# Altium schematic sheet IMU_Core.SchDoc
size A
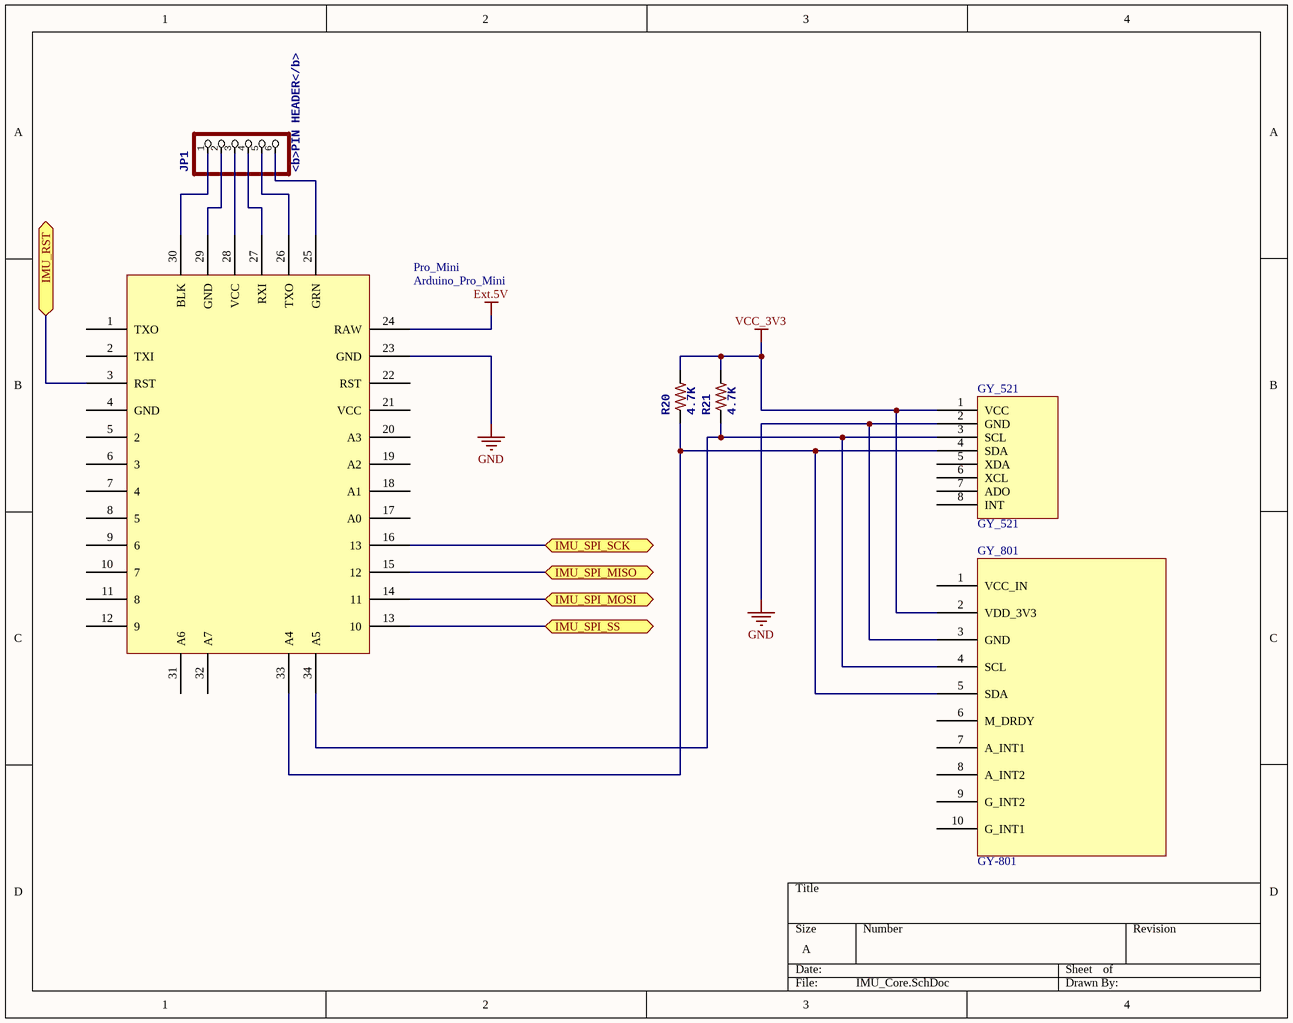
[diagram p0: IMU_Core.SchDoc]

## Parts
GY_521  GY_521  [sensor_8pin]
GY_801  GY-801  [Sensor_10Pin]
JP1  <b>PIN HEADER</b>  [1X06]
Pro_Mini  Arduino_Pro_Mini  [Arduino_pro_mini]
R20  4.7K  [R0805]
R21  4.7K  [R0805]

## Ports
IMU_RST, IMU_SPI_MISO, IMU_SPI_MOSI, IMU_SPI_SCK, IMU_SPI_SS

## Nets
Ext.5V: Pro_Mini.24(RAW)
GND: GY_521.2(GND) GY_801.3(GND) Pro_Mini.23(GND)
VCC_3V3: GY_521.1(VCC) GY_801.2(VDD_3V3) R20.2 R21.2
IMU_RST: Pro_Mini.3(RST) ; port IMU_RST
IMU_SPI_MISO: Pro_Mini.15(12) ; port IMU_SPI_MISO
IMU_SPI_MOSI: Pro_Mini.14(11) ; port IMU_SPI_MOSI
IMU_SPI_SCK: Pro_Mini.16(13) ; port IMU_SPI_SCK
IMU_SPI_SS: Pro_Mini.13(10) ; port IMU_SPI_SS
NetGY_521_3: GY_521.3(SCL) GY_801.4(SCL) Pro_Mini.34(A5) R21.1
NetGY_521_4: GY_521.4(SDA) GY_801.5(SDA) Pro_Mini.33(A4) R20.1
NetJP1_1: JP1.1 Pro_Mini.30(BLK)
NetJP1_2: JP1.2 Pro_Mini.29(GND)
NetJP1_3: JP1.3 Pro_Mini.28(VCC)
NetJP1_4: JP1.4 Pro_Mini.27(RXI)
NetJP1_5: JP1.5 Pro_Mini.26(TXO)
NetJP1_6: JP1.6 Pro_Mini.25(GRN)

Not connected (* = marked no-connect by the designer): GY_521 5(XDA) 6(XCL) 7(ADO) 8(INT); GY_801 1(VCC_IN) 6(M_DRDY) 7(A_INT1) 8(A_INT2) 9(G_INT2) 10(G_INT1); Pro_Mini 1(TXO) 2(TXI) 4(GND) 5(2) 6(3) 7(4) 8(5) 9(6) 10(7) 11(8) 12(9) 17(A0) 18(A1) 19(A2) 20(A3) 21(VCC) 22(RST) 31(A6) 32(A7)

## Library data of the parts
JP1 = PINHD-1X6
R20 R21 = R-US_R0805